# Altium schematic sheet Card_Interface.SchDoc
size A; SheetNumber: 10; SheetTotal: 16
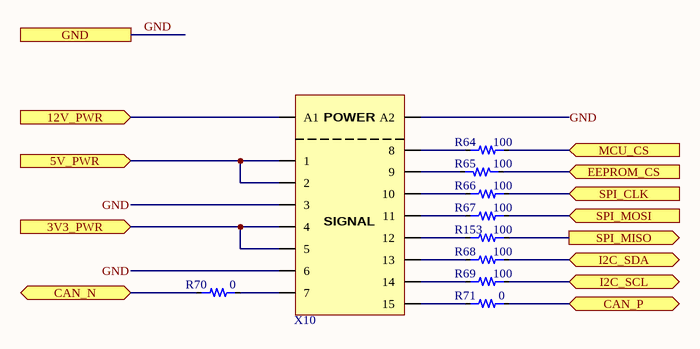
[diagram p0: Card_Interface.SchDoc]

## Parts
R64  value 100  [0603_RES]  (hidden comment: Resistor)
R65  value 100  [0603_RES]  (hidden comment: Resistor)
R66  value 100  [0603_RES]  (hidden comment: Resistor)
R67  value 100  [0603_RES]  (hidden comment: Resistor)
R68  value 100  [0603_RES]  (hidden comment: Resistor)
R69  value 100  [0603_RES]  (hidden comment: Resistor)
R70  value 0  [0603_RES]  (hidden comment: Resistor)
R71  value 0  [0603_RES]  (hidden comment: Resistor)
R153  value 100  [0603_RES]  (hidden comment: Resistor)
X10  681M17W2203L  [681M17W2203L]  (value not drawn)

## Ports
3V3_PWR (in), 5V_PWR (in), 12V_PWR (in), CAN_N (bidir), CAN_P (bidir), EEPROM_CS (in), GND, I2C_SCL (bidir), I2C_SDA (bidir), MCU_CS (in), SPI_CLK (in), SPI_MISO (out), SPI_MOSI (in)

## Nets
3V3_PWR: X10.4 X10.5 ; port 3V3_PWR
5V_PWR: X10.1 X10.2 ; port 5V_PWR
12V_PWR: X10.A1 ; port 12V_PWR
CAN_N: R70.1 ; port CAN_N
CAN_P: R71.1 ; port CAN_P
EEPROM_CS: R65.2 ; port EEPROM_CS
GND: X10.3 X10.6 X10.A2 ; port GND
I2C_SCL: R69.1 ; port I2C_SCL
I2C_SDA: R68.1 ; port I2C_SDA
MCU_CS: R64.1 ; port MCU_CS
SPI_CLK: R66.1 ; port SPI_CLK
SPI_MISO: R153.1 ; port SPI_MISO
SPI_MOSI: R67.1 ; port SPI_MOSI
NetR64_2: R64.2 X10.8
NetR65_1: R65.1 X10.9
NetR66_2: R66.2 X10.10
NetR67_2: R67.2 X10.11
NetR68_2: R68.2 X10.13
NetR69_2: R69.2 X10.14
NetR70_2: R70.2 X10.7
NetR71_2: R71.2 X10.15
NetR153_2: R153.2 X10.12

## Notes on the sheet
- (in symbol 681M17W2203L) POWER; SIGNAL

## Library data of the parts
X10 = 681M17W2203L: 17 (15 + 2 Power) Position D-Sub, Combo Receptacle, Female Sockets Connector; Circuits: 17; Name: 681M17W2203L; ComponentLink1Description: Digikey; ComponentLink1URL: https://www.digikey.com/en/products/detail/norcomp-inc/681M17W2203L001/4311857
R64-R71 R153 = Resistor: Tolerance: *